# EAGLE schematic PIC_WIFI_DEV (EAGLE 6.2)
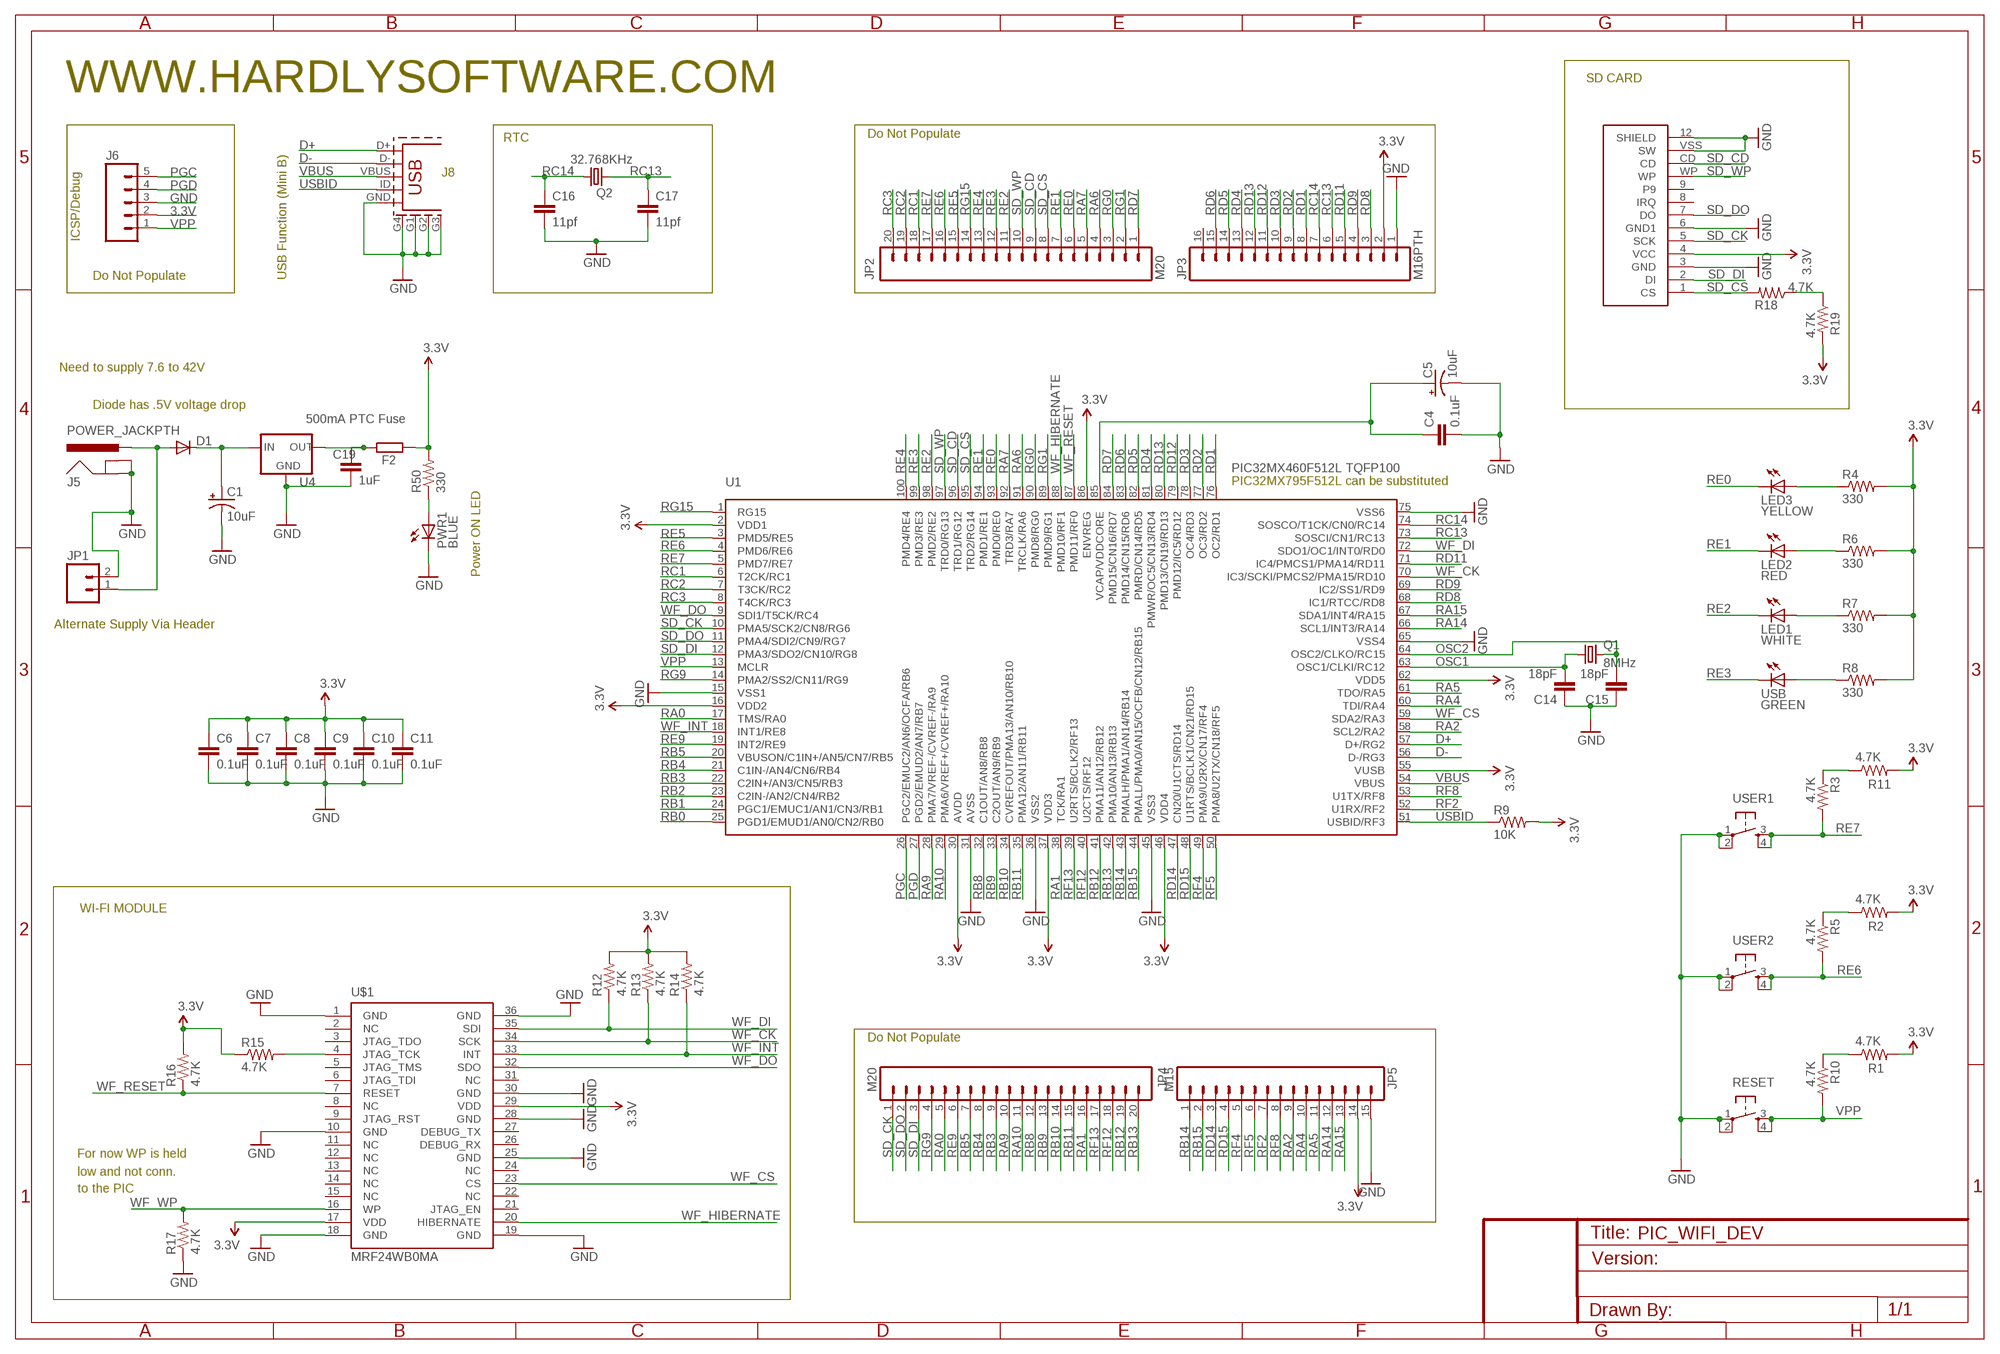
[diagram p0: schematic, sheet 1]

## Parts
C1  10uF  CAP_POL3528  [EIA3528]
C4  0.1uF  CAP0402  [C0402]
C5  10uF  CAP_POL3528  [EIA3528]
C6  0.1uF  CAP0402  [C0402]
C7  0.1uF  CAP0402  [C0402]
C8  0.1uF  CAP0402  [C0402]
C9  0.1uF  CAP0402  [C0402]
C10  0.1uF  CAP0402  [C0402]
C11  0.1uF  CAP0402  [C0402]
C14  18pF  CAP0402  [C0402]
C15  18pF  CAP0402  [C0402]
C16  11pf  CAP0402  [C0402]
C17  11pf  CAP0402  [C0402]
C19  1uF  CAP0603-CAP  [0603-CAP]
D1  DIODESMA  [SMA-DIODE]
F2  500mA PTC Fuse  R-EU_M1206  [M1206]
J5  POWER_JACKPTH  [POWER_JACK_PTH]
J6  M05PTH  [1X05]
J8  USB_5PIN  [USB-MINIB]
JP1  M02PTH  [1X02]
JP2  M20  [1X20]
JP3  M16PTH  [1X16]
JP4  M20  [1X20]
JP5  M15  [1X15]
LED1  WHITE  LED0603  [LED-0603]
LED2  RED  LED0603  [LED-0603]
LED3  YELLOW  LED0603  [LED-0603]
PWR1  BLUE  LED0603  [LED-0603]
Q1  8MHz  CRYSTAL5X3  [CRYSTAL-SMD-5X3]
Q2  32.768KHz  CRYSTAL4X2  [CRYSTAL-SMD-4X2]
R1  4.7K  RESISTOR0402  [C0402]
R2  4.7K  RESISTOR0402  [C0402]
R3  4.7K  RESISTOR0402  [C0402]
R4  330  RESISTOR0402  [C0402]
R5  4.7K  RESISTOR0402  [C0402]
R6  330  RESISTOR0402  [C0402]
R7  330  RESISTOR0402  [C0402]
R8  330  RESISTOR0402  [C0402]
R9  10K  RESISTOR0402  [C0402]
R10  4.7K  RESISTOR0402  [C0402]
R11  4.7K  RESISTOR0402  [C0402]
R12  4.7K  RESISTOR0603-RES  [0603-RES]
R13  4.7K  RESISTOR0603-RES  [0603-RES]
R14  4.7K  RESISTOR0603-RES  [0603-RES]
R15  4.7K  RESISTOR0603-RES  [0603-RES]
R16  4.7K  RESISTOR0603-RES  [0603-RES]
R17  4.7K  RESISTOR0603-RES  [0603-RES]
R18  4.7K  RESISTOR0603-RES  [0603-RES]
R19  4.7K  RESISTOR0603-RES  [0603-RES]
R50  330  RESISTOR0603-RES  [0603-RES]
RESET  TAC_SWITCHB3FS  [SWITCH-OMRON]
U1  PIC32MX460F512L TQFP100  PIC32MX4XXLTQFP100  [TQFP100]
U4  RECOM_X.X_REG78XX  [RECOM]
U$1  MRF24WB0MA  [SMD_MRF]
U$2  SD_CARD_SOCKETALPS  [SD_ALPS]
USB  GREEN  LED0603  [LED-0603]
USER1  TAC_SWITCHB3FS  [SWITCH-OMRON]
USER2  TAC_SWITCHB3FS  [SWITCH-OMRON]

## Nets
3.3V: C6.1 C7.1 C8.1 C9.1 C10.1 C11.1 F2.1 J6.2 JP3.2 JP5.14 R1.2 R2.2 R4.2 R6.2 R7.2 R8.2 R9.2 R11.2 R12.2 R13.2 R14.2 R15.1 R16.2 R19.2 R50.2 U1.2(VDD1) U1.16(VDD2) U1.30(AVDD) U1.37(VDD3) U1.46(VDD4) U1.55(VUSB) U1.62(VDD5) U1.86(ENVREG) U$1.17(VDD) U$1.29(VDD) U$2.4(VCC)
D+: J8.D+ U1.57(D+/RG2)
D-: J8.D- U1.56(D-/RG3)
GND: C1.C(-) C4.2 C5.C(-) C6.2 C7.2 C8.2 C9.2 C10.2 C11.2 C14.1 C15.1 C16.2 C17.2 C19.2 J5.GND J5.GNDBREAK J6.3 J8.G1 J8.G2 J8.G3 J8.G4(SHIELD) J8.GND JP1.2 JP3.1 JP5.15 PWR1.C R17.1 RESET.1 RESET.2 U1.15(VSS1) U1.31(AVSS) U1.36(VSS2) U1.45(VSS3) U1.65(VSS4) U1.75(VSS6) U4.GND U$1.1(GND) U$1.10(GND) U$1.18(GND) U$1.19(GND) U$1.25(GND) U$1.28(GND) U$1.30(GND) U$1.36(GND) U$2.3(GND) U$2.6(GND1) U$2.12(SHIELD) U$2.VSS(SW) USER1.1 USER1.2 USER2.1 USER2.2
N$1: R1.1 R10.1
N$2: D1.A J5.PWR JP1.1
N$3: R2.1 R5.1
N$4: R3.1 R11.1
N$5: R15.2 U$1.4(JTAG_TCK)
N$10: R18.1 R19.1
N$19: PWR1.A R50.1
N$20: R8.1 USB.A
N$22: LED1.A R7.1
N$23: LED2.A R6.1
N$24: C19.1 F2.2 U4.VOUT(OUT)
N$35: LED3.A R4.1
N$110: C4.1 C5.A(+) U1.85(VCAP/VDDCORE)
OSC1: C14.2 Q1.1 U1.63(OSC1/CLKI/RC12)
OSC2: C15.2 Q1.3 U1.64(OSC2/CLKO/RC15)
PGC: J6.5 U1.26(PGC2/EMUC2/AN6/OCFA/RB6)
PGD: J6.4 U1.27(PGD2/EMUD2/AN7/RB7)
RA0: JP4.5 U1.17(TMS/RA0)
RA1: JP4.16 U1.38(TCK/RA1)
RA2: JP5.9 U1.58(SCL2/RA2)
RA4: JP5.10 U1.60(TDI/RA4)
RA5: JP5.11 U1.61(TDO/RA5)
RA6: JP2.4 U1.91(TRCLK/RA6)
RA7: JP2.5 U1.92(TRD3/RA7)
RA9: JP4.10 U1.28(PMA7/VREF-/CVREF-/RA9)
RA10: JP4.11 U1.29(PMA6/VREF+/CVREF+/RA10)
RA14: JP5.12 U1.66(SCL1/INT3/RA14)
RA15: JP5.13 U1.67(SDA1/INT4/RA15)
RB0: U1.25(PGD1/EMUD1/AN0/CN2/RB0)
RB1: U1.24(PGC1/EMUC1/AN1/CN3/RB1)
RB2: U1.23(C2IN-/AN2/CN4/RB2)
RB3: JP4.9 U1.22(C2IN+/AN3/CN5/RB3)
RB4: JP4.8 U1.21(C1IN-/AN4/CN6/RB4)
RB5: JP4.7 U1.20(VBUSON/C1IN+/AN5/CN7/RB5)
RB8: JP4.12 U1.32(C1OUT/AN8/RB8)
RB9: JP4.13 U1.33(C2OUT/AN9/RB9)
RB10: JP4.14 U1.34(CVREFOUT/PMA13/AN10/RB10)
RB11: JP4.15 U1.35(PMA12/AN11/RB11)
RB12: JP4.19 U1.41(PMA11/AN12/RB12)
RB13: JP4.20 U1.42(PMA10/AN13/RB13)
RB14: JP5.1 U1.43(PMALH/PMA1/AN14/RB14)
RB15: JP5.2 U1.44(PMALL/PMA0/AN15/OCFB/CN12/RB15)
RC1: JP2.18 U1.6(T2CK/RC1)
RC2: JP2.19 U1.7(T3CK/RC2)
RC3: JP2.20 U1.8(T4CK/RC3)
RC13: C17.1 JP3.6 Q2.P$2 U1.73(SOSCI/CN1/RC13)
RC14: C16.1 JP3.7 Q2.P$1 U1.74(SOSCO/T1CK/CN0/RC14)
RD1: JP3.8 U1.76(OC2/RD1)
RD2: JP3.9 U1.77(OC3/RD2)
RD3: JP3.10 U1.78(OC4/RD3)
RD4: JP3.13 U1.81(PMWR/OC5/CN13/RD4)
RD5: JP3.14 U1.82(PMRD/CN14/RD5)
RD6: JP3.15 U1.83(PMD14/CN15/RD6)
RD7: JP2.1 U1.84(PMD15/CN16/RD7)
RD8: JP3.3 U1.68(IC1/RTCC/RD8)
RD9: JP3.4 U1.69(IC2/SS1/RD9)
RD11: JP3.5 U1.71(IC4/PMCS1/PMA14/RD11)
RD12: JP3.11 U1.79(PMD12/IC5/RD12)
RD13: JP3.12 U1.80(PMD13/CN19/RD13)
RD14: JP5.3 U1.47(CN20/U1CTS/RD14)
RD15: JP5.4 U1.48(U1RTS/BCLK1/CN21/RD15)
RE0: JP2.6 LED3.C U1.93(PMD0/RE0)
RE1: JP2.7 LED2.C U1.94(PMD1/RE1)
RE2: JP2.11 LED1.C U1.98(PMD2/RE2)
RE3: JP2.12 U1.99(PMD3/RE3) USB.C
RE4: JP2.13 U1.100(PMD4/RE4)
RE5: JP2.15 U1.3(PMD5/RE5)
RE6: JP2.16 R5.2 U1.4(PMD6/RE6) USER2.3 USER2.4
RE7: JP2.17 R3.2 U1.5(PMD7/RE7) USER1.3 USER1.4
RE9: JP4.6 U1.19(INT2/RE9)
RF2: JP5.7 U1.52(U1RX/RF2)
RF4: JP5.5 U1.49(PMA9/U2RX/CN17/RF4)
RF5: JP5.6 U1.50(PMA8/U2TX/CN18/RF5)
RF8: JP5.8 U1.53(U1TX/RF8)
RF12: JP4.18 U1.40(U2CTS/RF12)
RF13: JP4.17 U1.39(U2RTS/BCLK2/RF13)
RG0: JP2.3 U1.90(PMD8/RG0)
RG1: JP2.2 U1.89(PMD9/RG1)
RG9: JP4.4 U1.14(PMA2/SS2/CN11/RG9)
RG15: JP2.14 U1.1(RG15)
SD_CD: JP2.9 U1.96(TRD1/RG12) U$2.CD
SD_CK: JP4.1 U1.10(PMA5/SCK2/CN8/RG6) U$2.5(SCK)
SD_CS: JP2.8 R18.2 U1.95(TRD2/RG14) U$2.1(CS)
SD_DI: JP4.3 U1.12(PMA3/SDO2/CN10/RG8) U$2.2(DI)
SD_DO: JP4.2 U1.11(PMA4/SDI2/CN9/RG7) U$2.7(DO)
SD_WP: JP2.10 U1.97(TRD0/RG13) U$2.WP
USBID: J8.ID(USB_ID) R9.1 U1.51(USBID/RF3)
VBUS: J8.VBUS U1.54(VBUS)
VIN_RAW: C1.A(+) D1.C U4.VIN(IN)
VPP: J6.1 R10.2 RESET.3 RESET.4 U1.13(MCLR)
WF_CK: R13.1 U1.70(IC3/SCKI/PMCS2/PMA15/RD10) U$1.34(SCK)
WF_CS: U1.59(SDA2/RA3) U$1.23(CS)
WF_DI: R12.1 U1.72(SDO1/OC1/INT0/RD0) U$1.35(SDI)
WF_DO: U1.9(SDI1/T5CK/RC4) U$1.32(SDO)
WF_HIBERNATE: U1.88(PMD10/RF1) U$1.20(HIBERNATE)
WF_INT: R14.1 U1.18(INT1/RE8) U$1.33(INT)
WF_RESET: R16.1 U1.87(PMD11/RF0) U$1.7(RESET)
WF_WP: R17.2 U$1.16(WP)
Unconnected: JP3.16 U$1.2(NC) U$1.3(JTAG_TDO) U$1.5(JTAG_TMS) U$1.6(JTAG_TDI) U$1.8(NC) U$1.9(JTAG_RST) U$1.11(NC) U$1.12(NC) U$1.13(NC) U$1.14(NC) U$1.15(NC) U$1.21(JTAG_EN) U$1.22(NC) U$1.24(NC) U$1.26(DEBUG_RX) U$1.27(DEBUG_TX) U$1.31(NC) U$2.8(IRQ) U$2.9

## Notes on the sheet
- SD CARD
- WWW.HARDLYSOFTWARE.COM
- Do Not Populate
- RTC
- J8
- ICSP/Debug
- Do Not Populate | USB Function (Mini B)
- Need to supply 7.6 to 42V
- Diode has .5V voltage drop
- PIC32MX795F512L can be substituted
- Power ON LED
- Alternate Supply Via Header
- WI-FI MODULE
- Do Not Populate
- For now WP is held
- low and not conn.
- to the PIC

## Library data of the parts
C1 C5 = SparkFun02-20-08:CAP_POL: Capacitor Polarized These are standard SMD and PTH capacitors. Normally 10uF, 47uF, and 100uF in electrolytic and tantalum varieties. Always verify the external diameter of the through hole cap, it varies with capacity, voltage, and manufacturer. The EIA devices should be standard.
C4 C6-C9 C11 C14-C17 = SparkFun:CAP: Capacitor Standard 0603 ceramic capacitor, and 0.1" leaded capacitor.
C10 = SparkFun02-20-08:CAP: Capacitor Standard 0603 ceramic capacitor, and 0.1" leaded capacitor.
C19 = SparkFun-Passives:CAP: Capacitor Standard 0603 ceramic capacitor, and 0.1" leaded capacitor.
D1 = SparkFun-12-01-09:DIODE: Diode These are standard reverse protection diodes and small signal diodes. SMA package can handle up to about 1A. SOD-323 can handle about 200mA. What the SOD-323 package when ordering, there are some mfgs out there that are 5-pin packages.
F2 = resistor:R-EU_: RESISTOR, European symbol
J5 = lizardworx:POWER_JACK: Power Jack This is the standard 5.5mm barrel jack for power. The PTH is the most common, proven, reliable, footprint. All others are experimental. The Slot footprint only works if the mill layer is transmitted to the PCB fab house so be warned. Spark Fun Electronics SKU : PRT-00119. Mating wall wart : TOL-00298 (and others)
J6 = SparkFun-12-01-09:M05: Header 5 Standard 5-pin 0.1" header. Use with straight break away headers (SKU : PRT-00116), right angle break away headers (PRT-00553), swiss pins (PRT-00743), machine pins (PRT-00117), and female headers (PRT-00115). Molex polarized connector foot print use with SKU : PRT-08230 with associated crimp pins and housings.
J8 = SparkFun02-20-08:USB_5PIN
JP1 = SparkFun-Connectors:M02: Header 2 Standard 2-pin 0.1" header. Use with straight break away headers (SKU : PRT-00116), right angle break away headers (PRT-00553), swiss pins (PRT-00743), machine pins (PRT-00117), and female headers (PRT-00115). Molex polarized connector foot print use with SKU : PRT-08233 with associated crimp pins and housings.
JP2 JP4 = SparkFun-Connectors:M20: 1x20 .1" header This is just like the LOCK variant in that the holes are staggared by 5 mil, but except for the last two holes. They are not altered from the "standard" footprint layout. This is used for a special purpose on the layout of our Graphic LCD Backpack. Make sure you want to use this device before selecting it for you project!
JP3 = SparkFun-Connectors:M16: 1x16 .1" header
JP5 = SparkFun-Connectors:M15: Header 15 Standard 15-pin 0.1" header. Use with straight break away headers (SKU : PRT-00116), right angle break away headers (PRT-00553), swiss pins (PRT-00743), machine pins (PRT-00117), and female headers (PRT-00115).
LED1-LED3 PWR1 USB = SparkFun:LED: LEDs Standard schematic elements and footprints for 5mm, 3mm, 1206, and 0603 sized LEDs. 5mm - Spark Fun Electronics SKU : COM-00529 (and others)
Q1 = SparkFun11_03_09:CRYSTAL: Crystals Various standard crystals. Proven footprints. Spark Fun Electronics SKU : COM-00534
Q2 = lizardworx:CRYSTAL: Various standard crystals. Proven footprints. Spark Fun Electronics SKU : COM-00534
R1-R11 = SparkFun:RESISTOR: Resistor
R12-R19 R50 = SparkFun-Passives:RESISTOR: Resistor
RESET USER1 USER2 = lizardworx:TAC_SWITCH: Momentary Switch Button commonly used for reset or general input. Spark Fun Electronics SKU : COM-00097
U1 = SchmalzHaus:PIC32MX4XXL
U4 = lizardworx:RECOM_X.X_REG
U$1 = lizardworx:MRF24WB0MA
U$2 = lizardworx:SD_CARD_SOCKET: SD/MMC Socket Media socket for SD and MMC cards. Push-push type. Schematic element and footprint production proven. Spark Fun Electronics SKU : PRT-00136